# EAGLE design AxionAdapterPogo (EAGLE 9.6.2)
REV: 1
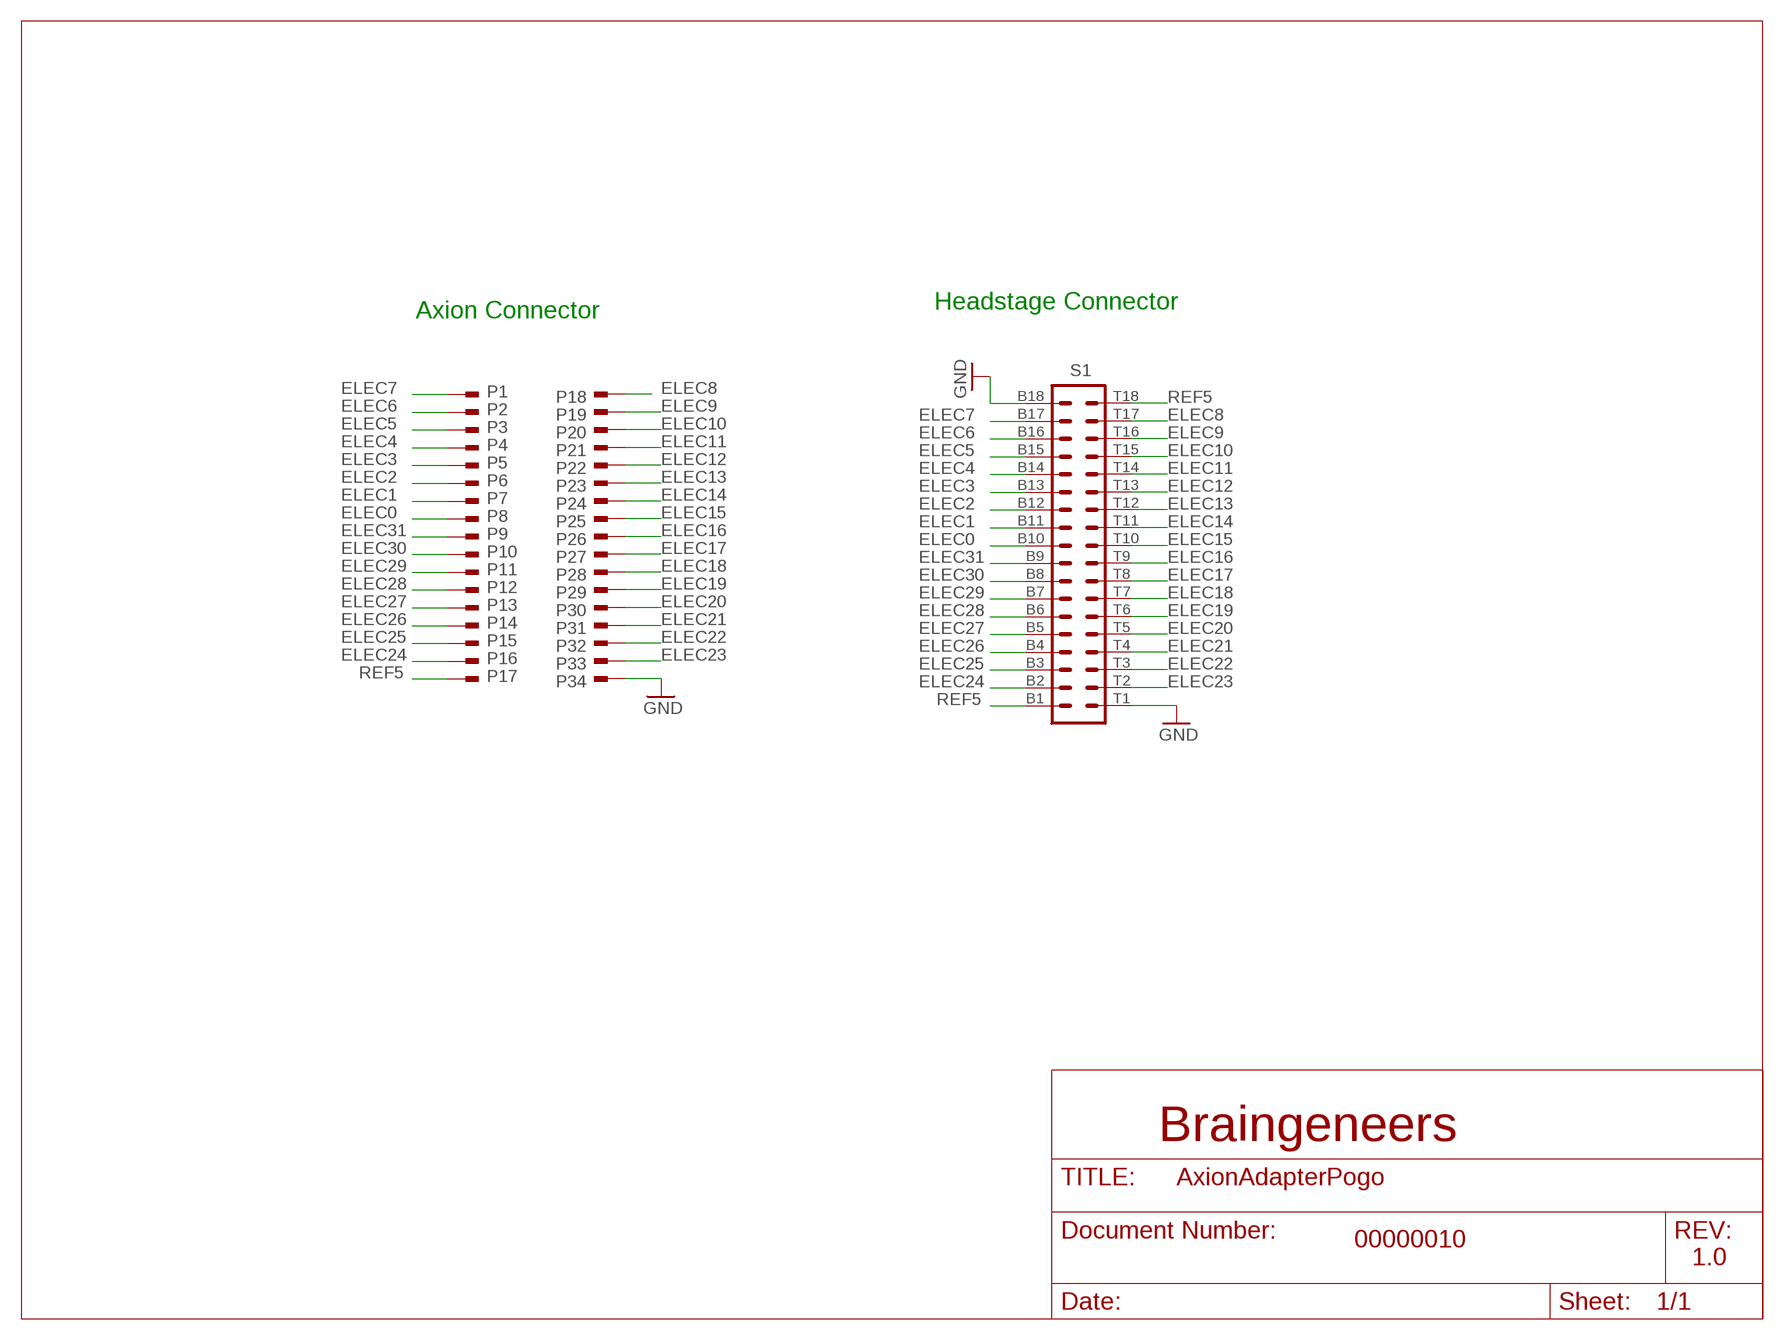
[diagram p0: schematic, sheet 1]

## Parts
P1  MILL-MAX_POGO_0985-0-15-20-71-14-11-0  [MILL-MAX_POGO_0985-0-15-20-71-14-11-0]
P2  MILL-MAX_POGO_0985-0-15-20-71-14-11-0  [MILL-MAX_POGO_0985-0-15-20-71-14-11-0]
P3  MILL-MAX_POGO_0985-0-15-20-71-14-11-0  [MILL-MAX_POGO_0985-0-15-20-71-14-11-0]
P4  MILL-MAX_POGO_0985-0-15-20-71-14-11-0  [MILL-MAX_POGO_0985-0-15-20-71-14-11-0]
P5  MILL-MAX_POGO_0985-0-15-20-71-14-11-0  [MILL-MAX_POGO_0985-0-15-20-71-14-11-0]
P6  MILL-MAX_POGO_0985-0-15-20-71-14-11-0  [MILL-MAX_POGO_0985-0-15-20-71-14-11-0]
P7  MILL-MAX_POGO_0985-0-15-20-71-14-11-0  [MILL-MAX_POGO_0985-0-15-20-71-14-11-0]
P8  MILL-MAX_POGO_0985-0-15-20-71-14-11-0  [MILL-MAX_POGO_0985-0-15-20-71-14-11-0]
P9  MILL-MAX_POGO_0985-0-15-20-71-14-11-0  [MILL-MAX_POGO_0985-0-15-20-71-14-11-0]
P10  MILL-MAX_POGO_0985-0-15-20-71-14-11-0  [MILL-MAX_POGO_0985-0-15-20-71-14-11-0]
P11  MILL-MAX_POGO_0985-0-15-20-71-14-11-0  [MILL-MAX_POGO_0985-0-15-20-71-14-11-0]
P12  MILL-MAX_POGO_0985-0-15-20-71-14-11-0  [MILL-MAX_POGO_0985-0-15-20-71-14-11-0]
P13  MILL-MAX_POGO_0985-0-15-20-71-14-11-0  [MILL-MAX_POGO_0985-0-15-20-71-14-11-0]
P14  MILL-MAX_POGO_0985-0-15-20-71-14-11-0  [MILL-MAX_POGO_0985-0-15-20-71-14-11-0]
P15  MILL-MAX_POGO_0985-0-15-20-71-14-11-0  [MILL-MAX_POGO_0985-0-15-20-71-14-11-0]
P16  MILL-MAX_POGO_0985-0-15-20-71-14-11-0  [MILL-MAX_POGO_0985-0-15-20-71-14-11-0]
P17  MILL-MAX_POGO_0985-0-15-20-71-14-11-0  [MILL-MAX_POGO_0985-0-15-20-71-14-11-0]
P18  MILL-MAX_POGO_0985-0-15-20-71-14-11-0  [MILL-MAX_POGO_0985-0-15-20-71-14-11-0]
P19  MILL-MAX_POGO_0985-0-15-20-71-14-11-0  [MILL-MAX_POGO_0985-0-15-20-71-14-11-0]
P20  MILL-MAX_POGO_0985-0-15-20-71-14-11-0  [MILL-MAX_POGO_0985-0-15-20-71-14-11-0]
P21  MILL-MAX_POGO_0985-0-15-20-71-14-11-0  [MILL-MAX_POGO_0985-0-15-20-71-14-11-0]
P22  MILL-MAX_POGO_0985-0-15-20-71-14-11-0  [MILL-MAX_POGO_0985-0-15-20-71-14-11-0]
P23  MILL-MAX_POGO_0985-0-15-20-71-14-11-0  [MILL-MAX_POGO_0985-0-15-20-71-14-11-0]
P24  MILL-MAX_POGO_0985-0-15-20-71-14-11-0  [MILL-MAX_POGO_0985-0-15-20-71-14-11-0]
P25  MILL-MAX_POGO_0985-0-15-20-71-14-11-0  [MILL-MAX_POGO_0985-0-15-20-71-14-11-0]
P26  MILL-MAX_POGO_0985-0-15-20-71-14-11-0  [MILL-MAX_POGO_0985-0-15-20-71-14-11-0]
P27  MILL-MAX_POGO_0985-0-15-20-71-14-11-0  [MILL-MAX_POGO_0985-0-15-20-71-14-11-0]
P28  MILL-MAX_POGO_0985-0-15-20-71-14-11-0  [MILL-MAX_POGO_0985-0-15-20-71-14-11-0]
P29  MILL-MAX_POGO_0985-0-15-20-71-14-11-0  [MILL-MAX_POGO_0985-0-15-20-71-14-11-0]
P30  MILL-MAX_POGO_0985-0-15-20-71-14-11-0  [MILL-MAX_POGO_0985-0-15-20-71-14-11-0]
P31  MILL-MAX_POGO_0985-0-15-20-71-14-11-0  [MILL-MAX_POGO_0985-0-15-20-71-14-11-0]
P32  MILL-MAX_POGO_0985-0-15-20-71-14-11-0  [MILL-MAX_POGO_0985-0-15-20-71-14-11-0]
P33  MILL-MAX_POGO_0985-0-15-20-71-14-11-0  [MILL-MAX_POGO_0985-0-15-20-71-14-11-0]
P34  MILL-MAX_POGO_0985-0-15-20-71-14-11-0  [MILL-MAX_POGO_0985-0-15-20-71-14-11-0]
S1  OMNETICS_A79024  [OMNETICS_A79024]

## Nets
ELEC0: P8.P$1 S1.B10
ELEC1: P7.P$1 S1.B11
ELEC2: P6.P$1 S1.B12
ELEC3: P5.P$1 S1.B13
ELEC4: P4.P$1 S1.B14
ELEC5: P3.P$1 S1.B15
ELEC6: P2.P$1 S1.B16
ELEC7: P1.P$1 S1.B17
ELEC8: P18.P$1 S1.T17
ELEC9: P19.P$1 S1.T16
ELEC10: P20.P$1 S1.T15
ELEC11: P21.P$1 S1.T14
ELEC12: P22.P$1 S1.T13
ELEC13: P23.P$1 S1.T12
ELEC14: P24.P$1 S1.T11
ELEC15: P25.P$1 S1.T10
ELEC16: P26.P$1 S1.T9
ELEC17: P27.P$1 S1.T8
ELEC18: P28.P$1 S1.T7
ELEC19: P29.P$1 S1.T6
ELEC20: P30.P$1 S1.T5
ELEC21: P31.P$1 S1.T4
ELEC22: P32.P$1 S1.T3
ELEC23: P33.P$1 S1.T2
ELEC24: P16.P$1 S1.B2
ELEC25: P15.P$1 S1.B3
ELEC26: P14.P$1 S1.B4
ELEC27: P13.P$1 S1.B5
ELEC28: P12.P$1 S1.B6
ELEC29: P11.P$1 S1.B7
ELEC30: P10.P$1 S1.B8
ELEC31: P9.P$1 S1.B9
GND [power]: P34.P$1 S1.B18 S1.T1
REF5: P17.P$1 S1.B1 S1.T18

## Notes on the sheet
- Headstage Connector
- Axion Connector
- Braingeneers
- 00000010
- 1.0

## Library data of the parts
P1-P34 = Braingeneers_Lib:MILL-MAX_POGO_0985-0-15-20-71-14-11-0
S1 = Braingeneers_Lib:OMNETICS_A79024: Omnetics A79024 36-pin connector

## Net classes
0 default: width 0.152 mm
1 thick: width 0.254 mm
2 power: width 0.61 mm
3 diff pairs: width 0.152 mm

## Board
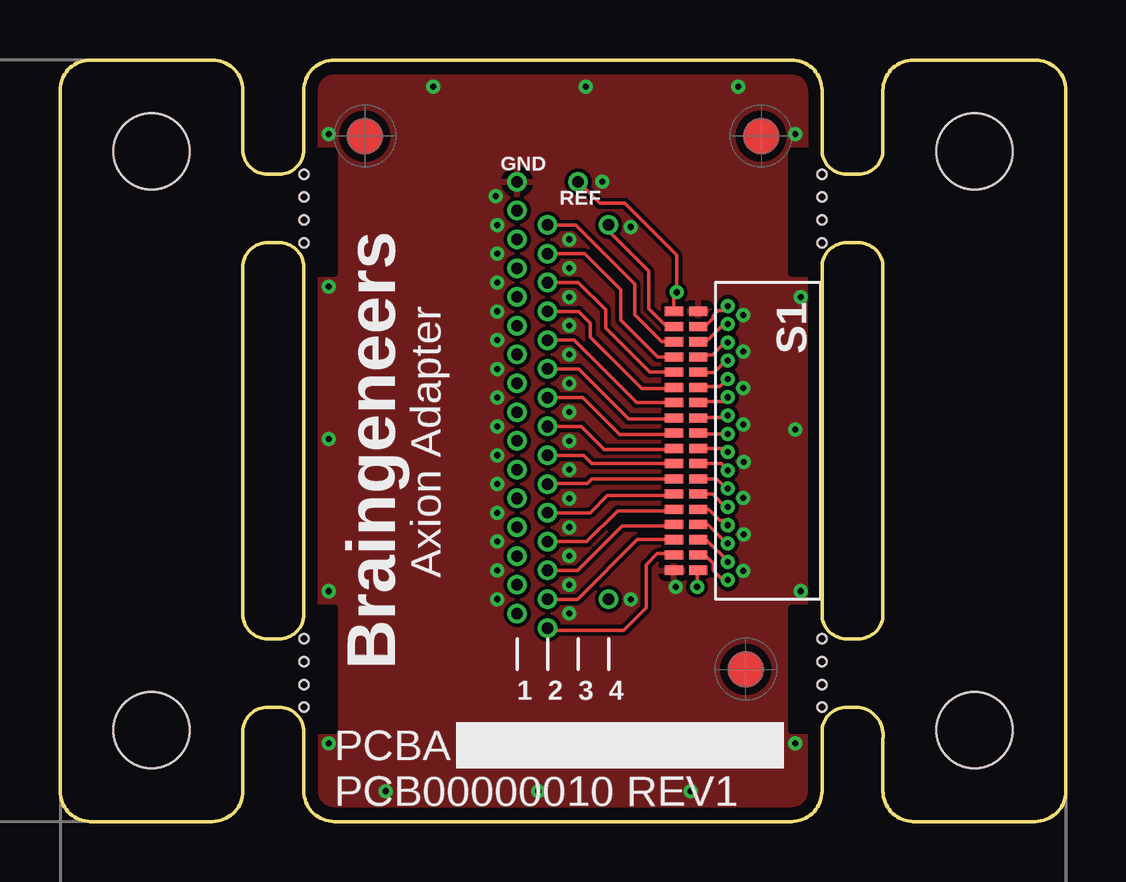
[diagram p1: board, top side]
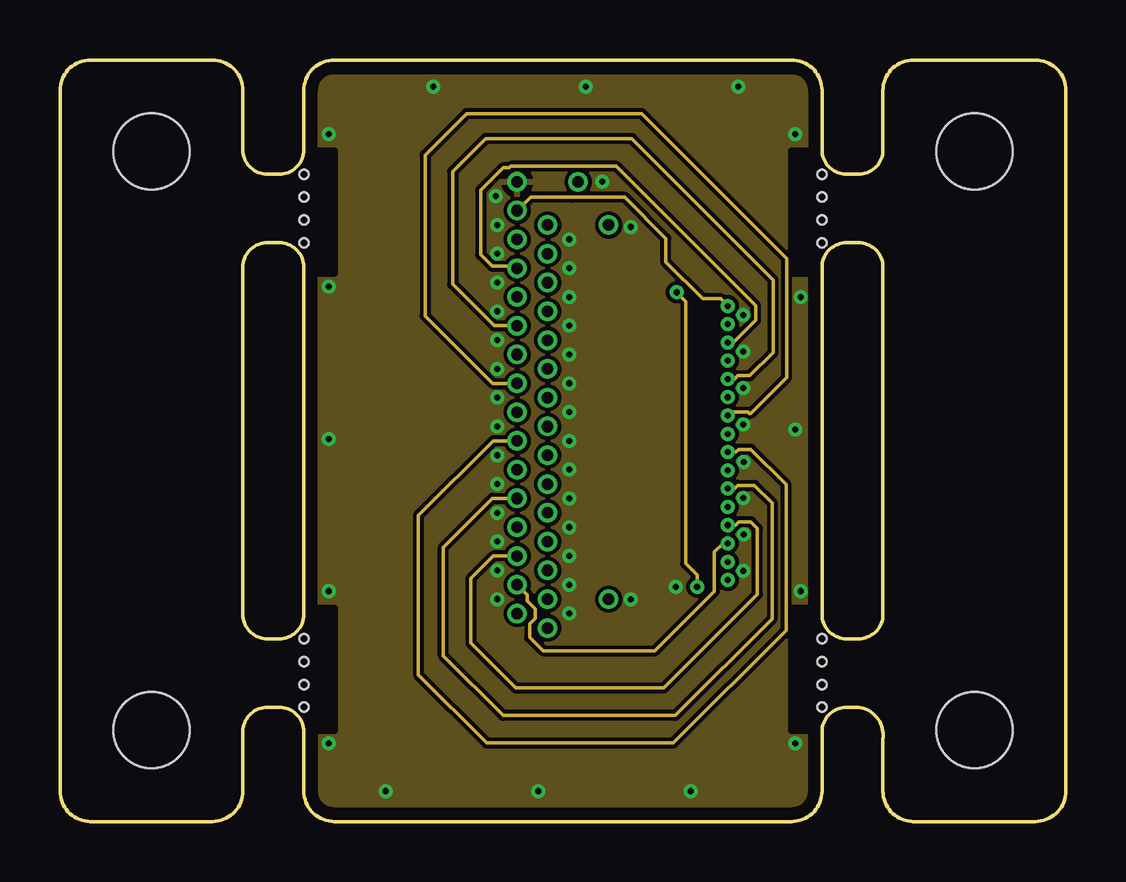
[diagram p2: board, inner layer Signal/Power2]
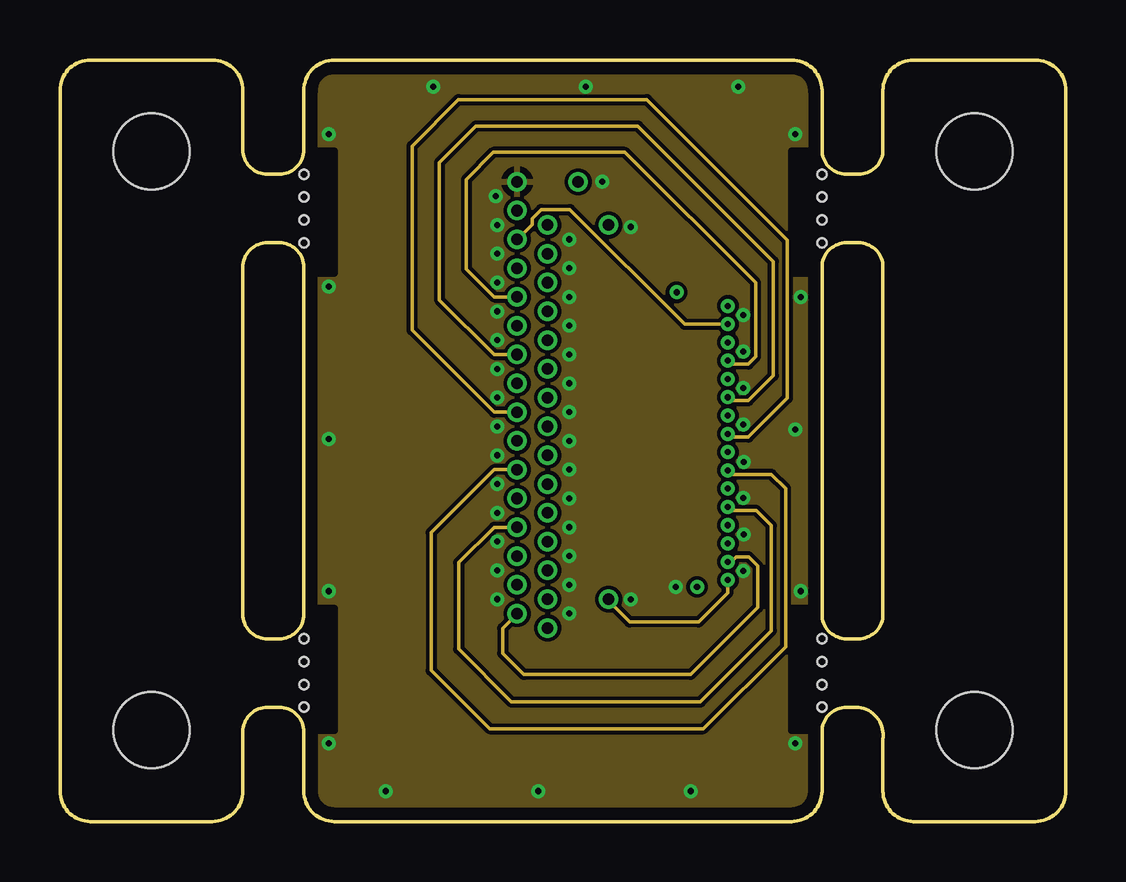
[diagram p3: board, inner layer Signal/Power3]
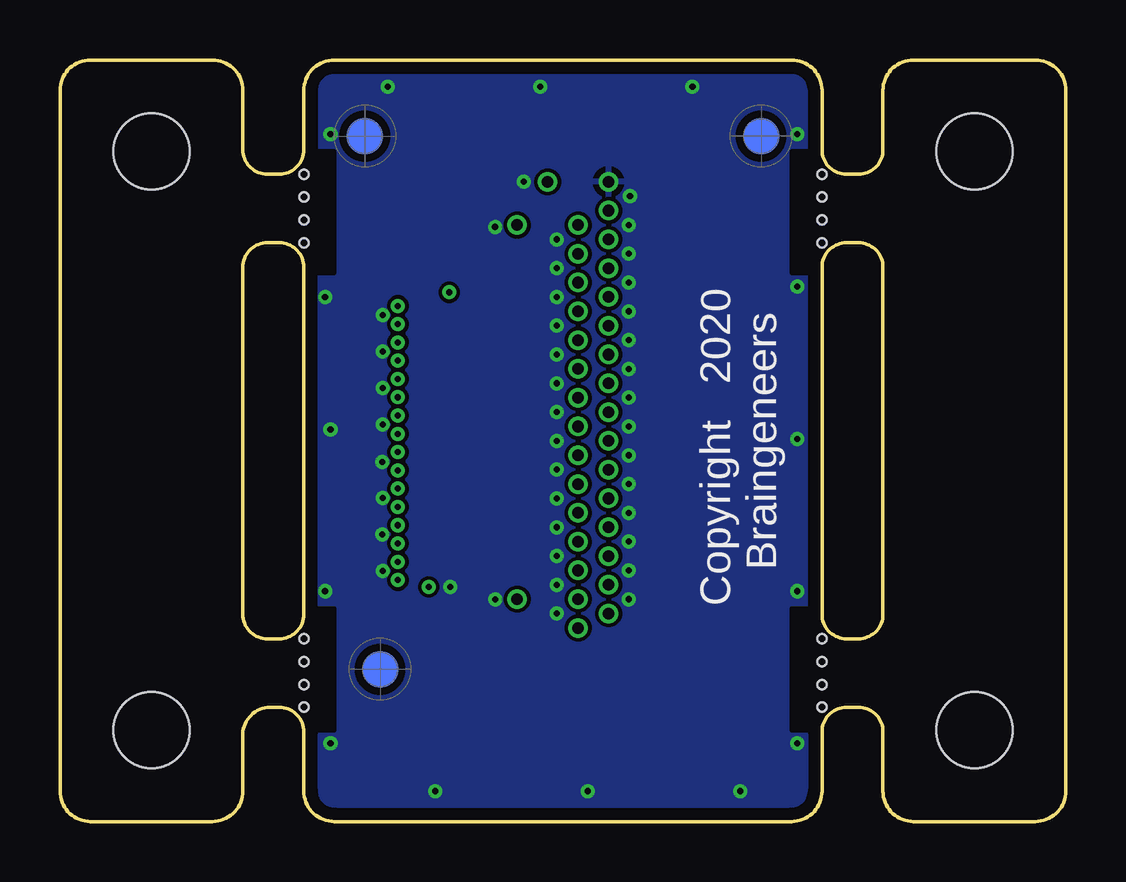
[diagram p4: board, bottom side, seen from below]

Size 41.91 x 31.75 mm. Coordinates in mm from the lower left corner, seen from the top.
Outline: 31.75,1.27 31.75,3.75 arc-90 32.77,4.76 33.27,4.76 arc-90 34.29,3.43 34.29,1.27 arc90 35.56,0 40.64,0 arc90 41.91,1.27 41.91,30.48 arc90 40.64,31.75 35.56,31.75 arc90 34.29,30.48 34.29,28 arc-90 33.27,26.99 32.77,26.99 arc-90 31.75,28 31.75,30.48 arc90 30.48,31.75 11.43,31.75 arc90 10.16,30.48 10.16,28 arc-90 9.14,26.99 8.64,26.99 arc-90 7.62,28 7.62,30.48 arc90 6.35,31.75 1.27,31.75 arc90 0,30.48 0,1.27 arc90 1.27,0 6.35,0 arc90 7.62,1.27 7.62,3.75 arc-90 8.64,4.76 9.14,4.76 arc-90 10.16,3.75 10.16,1.27 arc90 11.43,0 30.48,0 arc90 31.75,1.27
Outline: 8.64,24.13 9.14,24.13 arc-90 10.16,23.11 10.16,8.64 arc-90 9.14,7.62 8.64,7.62 arc-90 7.62,8.64 7.62,23.11 arc-90 8.64,24.13
Outline: 31.75,8.64 31.75,23.11 arc-90 32.77,24.13 33.27,24.13 arc-90 34.29,23.11 34.29,8.64 arc-90 33.27,7.62 32.77,7.62 arc-90 31.75,8.64
Copper layers (1+2*15+16): Top(GND)1 0.035mm / dielectric 8mil / Signal/Power2 0.035mm / dielectric 1.0284mm / Signal/Power3 0.035mm / dielectric 8mil / Bottom(GND)4 0.035mm
Design rules "default *": minimum track width 6mil, minimum drill 10mil, track to track 6mil, track to pad 6.5mil, pad to pad 6mil, via to via 6mil, smd to smd 6mil, copper to edge 20mil, drill to drill 15mil, minimum pad ring 6.5mil, minimum via ring 6.5mil, stop-mask expansion 3mil, vias tented up to drill 12mil, thermal gap 10mil
Holes 0.38 mm at 31.75,4.76 31.75,7.62 31.75,6.67 31.75,5.72 31.75,24.13 31.75,26.99 31.75,26.04 31.75,25.08 10.16,24.13 10.16,26.99 10.16,26.04 10.16,25.08 10.16,4.76 10.16,7.62 10.16,6.67 10.16,5.72
Holes 3.17 mm at 38.1,3.81 38.1,27.94 3.81,27.94 3.81,3.81
tKeepout: area 10.2,22.9 to 11.4,27.9; area 10.2,3.8 to 11.4,8.9; area 30.5,3.8 to 31.8,8.9; area 30.5,22.9 to 31.8,27.9
bKeepout: area 10.2,22.9 to 11.4,27.9; area 10.2,3.8 to 11.4,8.9; area 30.5,3.8 to 31.8,8.9; area 30.5,22.9 to 31.8,27.9
tRestrict: area 10.2,22.9 to 11.4,27.9; area 30.5,22.9 to 31.8,27.9; area 30.5,3.8 to 31.8,8.9; area 10.2,3.8 to 11.4,8.9
bRestrict: area 10.2,22.9 to 11.4,27.9; area 10.2,3.8 to 11.4,8.9; area 30.5,3.8 to 31.8,8.9; area 30.5,22.9 to 31.8,27.9

### Footprints (pad centres in the part's own frame; a part is rotated, then mirrored left to right if it is on the bottom)
MILL-MAX_POGO_0985-0-15-20-71-14-11-0 = drill 0.483: P$1 0,0
OMNETICS_A79024 = smd 0.381 x 0.762: B1 -5.397,0.711; B2 -4.763,0.711; B3 -4.128,0.711; B4 -3.493,0.711; B5 -2.857,0.711; B6 -2.223,0.711; B7 -1.587,0.711; B8 -0.953,0.711; B9 -0.318,0.711; B10 0.318,0.711; B11 0.953,0.711; B12 1.587,0.711; B13 2.223,0.711; B14 2.857,0.711; B15 3.493,0.711; B16 4.128,0.711; B17 4.763,0.711; B18 5.397,0.711; T1 -5.397,1.727; T2 -4.763,1.727; T3 -4.128,1.727; T4 -3.493,1.727; T5 -2.857,1.727; T6 -2.223,1.727; T7 -1.587,1.727; T8 -0.953,1.727; T9 -0.318,1.727; T10 0.318,1.727; T11 0.953,1.727; T12 1.587,1.727; T13 2.223,1.727; T14 2.857,1.727; T15 3.493,1.727; T16 4.128,1.727; T17 4.763,1.727; T18 5.397,1.727

### Placement (x,y rotation side)
DRILEGEND  [DRILEGEND]  21.21,-23.02 0 top  (outside the outline)
P1  19.05,25.47 180 bottom
P2  19.05,24.27 180 bottom
P3  19.05,23.07 180 bottom
P4  19.05,21.87 180 bottom
P5  19.05,20.67 180 bottom
P6  19.05,19.47 180 bottom
P7  19.05,18.27 180 bottom
P8  19.05,17.07 180 bottom
P9  19.05,15.87 180 bottom
P10  19.05,14.67 180 bottom
P11  19.05,13.47 180 bottom
P12  19.05,12.27 180 bottom
P13  19.05,11.07 180 bottom
P14  19.05,9.87 180 bottom
P15  19.05,8.67 180 bottom
P16  22.86,9.27 90 bottom
P17  21.59,26.67 0 bottom
P18  22.86,24.87 90 bottom
P19  20.32,24.87 0 bottom
P20  20.32,23.67 0 bottom
P21  20.32,22.47 0 bottom
P22  20.32,21.27 0 bottom
P23  20.32,20.07 0 bottom
P24  20.32,18.87 0 bottom
P25  20.32,17.67 0 bottom
P26  20.32,16.47 0 bottom
P27  20.32,15.27 0 bottom
P28  20.32,14.07 0 bottom
P29  20.32,12.87 0 bottom
P30  20.32,11.67 0 bottom
P31  20.32,10.47 0 bottom
P32  20.32,9.27 0 bottom
P33  20.32,8.07 0 bottom
P34  19.05,26.67 180 bottom
S1  27.3,15.88 90 top
U$1  [FIDUCIAL_G15]  12.7,28.58 270 top
U$2  [FIDUCIAL_G15]  12.7,28.58 270 bottom
U$7  [NASS_LOGO_LG]  27.42,2.48 349.7 bottom
U$31  [ROHS_LG]  24.44,9.01 0 top
U$35  [FIDUCIAL_G15]  29.21,28.58 270 top
U$49  [FIDUCIAL_G15]  28.58,6.35 90 top
U$50  [FIDUCIAL_G15]  28.58,6.35 270 bottom
U$52  [A5L-LOC]  -25.3,-72.07 0 top  (outside the outline)
U$70  [NO_TRASH_LG]  22.96,16.64 0 top
U$72  [STATIC_LG]  23.54,12.53 0 top
U$73  [FIDUCIAL_G15]  29.21,28.58 0 bottom
U$84  [COMPYRIGHT_MED]  13.34,17.15 270 top

### Tracks (layer width: path | path; a pad name or v marks a point on that pad's centre or on a via)
ELEC0  (via drill 0.25)
  Top(GND)1 0.152: v27.83,16.16 26.62,16.16
  Top(GND)1 0.178: S1.B10 26.62,16.16
  Signal/Power3 0.152: v27.83,16.16 27.97,16.02 28.68,16.02 30.3,17.65 30.3,24.24 24.45,30.1 16.6,30.1 14.67,28.16 14.67,20.49 18.08,17.07 P8.P$1
ELEC1  (via drill 0.25)
  Top(GND)1 0.152: v27.83,16.93 27.75,16.85 26.61,16.85
  Top(GND)1 0.178: 26.61,16.85 S1.B11
  Signal/Power2 0.152: v27.83,16.93 27.97,17.07 28.68,17.07 28.73,17.02 28.78,17.02 30.28,18.52 30.28,23.47 24.23,29.52 16.94,29.52 15.21,27.79 15.21,21.08 18.03,18.27 P7.P$1
ELEC2  (via drill 0.25)
  Top(GND)1 0.152: v27.83,17.69 27.65,17.51 26.64,17.51 S1.B12
  Signal/Power3 0.152: v27.83,17.69 27.97,17.55 28.68,17.55 29.72,18.59 29.72,23.35 24.07,28.99 17.33,28.99 15.81,27.48 15.81,21.74 18.08,19.47 P6.P$1
ELEC3  (via drill 0.25)
  Top(GND)1 0.152: S1.B13 26.64,18.14 27.49,18.14 27.8,18.45 v27.83,18.45
  Signal/Power2 0.152: v27.83,18.45 28.11,18.45 28.25,18.59 28.75,18.59 29.72,19.56 29.72,22.58 23.82,28.47 17.73,28.47 16.36,27.1 16.36,22.4 18.08,20.67 P5.P$1
ELEC4  (via drill 0.25)
  Top(GND)1 0.152: S1.B14 27.26,18.73 27.75,19.21 v27.83,19.21
  Signal/Power3 0.152: v27.83,19.21 27.97,19.07 28.68,19.07 28.98,19.38 28.98,22.46 23.54,27.9 18.06,27.9 16.93,26.77 16.93,23.03 18.08,21.87 P4.P$1
ELEC5  (via drill 0.25)
  Top(GND)1 0.152: v27.83,19.97 27.7,19.97 27.17,19.44 26.67,19.44 S1.B15
  Signal/Power2 0.152: v27.83,19.97 28.06,19.97 28.98,20.9 28.98,21.51 23.18,27.32 18.78,27.32 18.72,27.25 18.47,27.25 17.53,26.31 17.53,23.63 18,23.15 18.97,23.15 P3.P$1
ELEC6  (via drill 0.25)
  Top(GND)1 0.152: v27.83,20.74 27.65,20.74 26.92,20 S1.B16
  Signal/Power3 0.152: P2.P$1 19.67,24.89 19.67,25.14 20.05,25.52 21.25,25.52 26.03,20.74 v27.83,20.74
ELEC7  (via drill 0.25)
  Top(GND)1 0.152: v27.83,21.5 27.63,21.3 27.42,21.3 27.22,21.09 27.22,20.98 26.87,20.64 S1.B17
  Signal/Power2 0.152: v27.83,21.5 27.53,21.79 26.77,21.79 25.25,23.32 25.25,24.31 23.53,26.02 21.32,26.02 21.31,26.04 19.62,26.04 P1.P$1
ELEC8
  Top(GND)1 0.152: P18.P$1 22.86,24.62 24.52,22.95 24.52,21.39 25.27,20.64 S1.T17
ELEC9
  Top(GND)1 0.152: P19.P$1 21.48,24.87 23.95,22.4 23.95,21.13 25.08,20 S1.T16
ELEC10
  Top(GND)1 0.152: S1.T15 24.91,19.37 23.37,20.91 23.37,22.17 21.86,23.67 P20.P$1
ELEC11
  Top(GND)1 0.152: S1.T14 24.57,18.73 22.73,20.57 22.73,21.34 21.6,22.47 P21.P$1
ELEC12
  Top(GND)1 0.152: P22.P$1 21.61,21.27 22.1,20.78 22.1,20.19 24.24,18.05 25.53,18.05 S1.T13
ELEC13
  Top(GND)1 0.152: P23.P$1 21.42,20.07 24.03,17.46 S1.T12
ELEC14
  Top(GND)1 0.152: S1.T11 25.53,16.78 23.7,16.78 21.61,18.87 P24.P$1
ELEC15
  Top(GND)1 0.152: S1.T10 25.53,16.14 23.32,16.14 21.79,17.67 P25.P$1
ELEC16
  Top(GND)1 0.152: S1.T9 25.53,15.51 22.68,15.51 21.72,16.47 P26.P$1
ELEC17
  Top(GND)1 0.152: P27.P$1 21.81,15.27 22.16,14.92 S1.T8
ELEC18
  Top(GND)1 0.152: P28.P$1 20.35,14.1 21.97,14.1 22.16,14.29 S1.T7
ELEC19
  Top(GND)1 0.152: P29.P$1 22.09,12.87 22.81,13.59 25.51,13.59 S1.T6
ELEC20
  Top(GND)1 0.152: P30.P$1 21.96,11.67 23.24,12.95 25.51,12.95 S1.T5
ELEC21
  Top(GND)1 0.152: P31.P$1 21.57,10.47 23.42,12.32 25.51,12.32 S1.T4
ELEC22
  Top(GND)1 0.152: P32.P$1 21.56,9.27 24.05,11.76 25.57,11.76 S1.T3
ELEC23
  Top(GND)1 0.152: S1.T2 25.51,11.18 24.89,11.18 24.42,10.71 24.42,8.91 23.48,7.98 20.41,7.98 P33.P$1
ELEC24  (via drill 0.25)
  Top(GND)1 0.152: v27.83,10.07 27.62,10.07 27.22,10.47 27.22,10.77 26.87,11.11 S1.B2
  Signal/Power3 0.152: P16.P$1 22.86,9.19 23.73,8.32 26.61,8.32 27.83,9.54 v27.83,10.07
ELEC25  (via drill 0.25)
  Top(GND)1 0.152: v27.83,10.83 27.83,10.86 26.94,11.75 S1.B3
  Signal/Power3 0.152: v27.83,10.83 27.98,10.83 28.18,11.03 28.69,11.03 29.07,10.65 29.07,8.93 26.28,6.13 19.33,6.13 18.44,7.02 18.44,8.06 P15.P$1
ELEC26  (via drill 0.25)
  Top(GND)1 0.152: S1.B4 26.62,12.36 27.01,12.36 27.78,11.59 v27.83,11.59
  Signal/Power2 0.152: P14.P$1 19.47,9.45 19.47,9.21 19.8,8.88 19.8,8.47 19.57,8.24 19.57,7.68 20.13,7.12 24.78,7.12 27.26,9.6 27.26,11.23 27.63,11.59 v27.83,11.59
ELEC27  (via drill 0.25)
  Top(GND)1 0.152: v27.83,12.35 27.63,12.56 27.5,12.56 27.04,13.02 S1.B5
  Signal/Power2 0.152: P13.P$1 18.05,11.07 17.12,10.14 17.12,7.44 19,5.56 25.15,5.56 29.06,9.47 29.06,12.22 28.78,12.49 28.27,12.49 28.13,12.35 v27.83,12.35
ELEC28  (via drill 0.25)
  Top(GND)1 0.152: v27.83,13.12 27.73,13.12 27.19,13.65 S1.B6
  Signal/Power3 0.152: P12.P$1 18.08,12.27 16.61,10.79 16.61,7.19 18.81,4.98 26.68,4.98 29.64,7.95 29.64,12.34 29.01,12.98 27.97,12.98 v27.83,13.12
ELEC29  (via drill 0.25)
  Top(GND)1 0.152: v27.83,13.88 27.78,13.88 27.37,14.29 S1.B7
  Signal/Power2 0.152: v27.83,13.88 28.11,13.88 28.25,14.02 28.93,14.02 29.67,13.28 29.67,8.46 25.63,4.42 18.47,4.42 15.98,6.91 15.98,11.43 18.02,13.47 P11.P$1
ELEC30  (via drill 0.25)
  Top(GND)1 0.152: v27.83,14.64 27.55,14.92 S1.B8
  Signal/Power3 0.152: v27.83,14.64 27.99,14.48 29.64,14.48 30.23,13.89 30.23,7.29 26.81,3.87 17.9,3.87 15.46,6.3 15.46,12.05 18.08,14.67 P10.P$1
ELEC31  (via drill 0.25)
  Top(GND)1 0.152: v27.83,15.4 27.67,15.56 S1.B9
  Signal/Power2 0.152: P9.P$1 18.05,15.87 14.94,12.75 14.94,6.12 17.78,3.28 25.55,3.28 30.25,7.98 30.25,14.05 28.78,15.52 28.27,15.52 28.16,15.4 v27.83,15.4
GND  (via drill 0.25)
  other vias: 18.16,26.07 18.22,24.87 18.22,23.67 18.22,22.47 18.22,21.27 18.22,20.07 18.22,18.87 18.22,17.67 18.22,16.47 18.22,15.27 18.22,14.07 18.22,12.87 18.22,11.67 18.22,10.47 18.22,9.27 22.59,26.67 21.22,9.87 21.22,24.27 21.22,23.07 25.65,9.78 28.46,10.45 28.46,21.12 28.46,19.59 28.46,18.07 28.46,16.55 28.49,15 28.46,13.5 28.49,11.97 21.22,8.67 23.78,24.79 11.19,28.65 28.26,30.64 30.64,28.65 30.87,21.86 30.87,9.6 11.19,22.3 26.27,1.27 11.19,3.25 11.19,9.6 11.19,15.95 30.64,16.35 21.22,11.07 21.22,12.27 21.22,13.47 21.22,14.67 21.22,15.87 21.22,17.07 21.22,18.27 21.22,19.47 21.22,20.67 21.22,21.87 23.78,9.26 30.64,3.25 19.92,1.27 15.56,30.64 21.91,30.64 13.57,1.27
  pour Bottom(GND)4 (rank 2): -15.93,-15.67 54.15,-15.67 54.15,46.87 -15.93,46.87
  pour Signal/Power3: -13.72,45.09 52.2,45.09 52.2,-14.35 -13.72,-14.35
  pour Signal/Power2: -11.43,-12.7 49.53,-12.7 49.53,43.18 -11.43,43.18
  pour Top(GND)1: -8.89,-10.16 46.99,-10.16 46.99,40.64 -8.89,40.64
REF5  (via drill 0.25)
  Top(GND)1 0.152: S1.B1 26.54,10.43 v26.54,9.78 | S1.T18 25.58,21.95 v25.69,22.06 25.69,23.62 23.54,25.77 22.49,25.77 P17.P$1
  Signal/Power2 0.152: v25.69,22.06 26.07,21.68 26.07,10.76 26.54,10.29 v26.54,9.78
TABS
  cutout Signal/Power3 (rank 2): 10.16,22.86 11.43,22.86 11.43,27.94 10.16,27.94
  cutout Signal/Power2 (rank 2): 10.16,22.86 11.43,22.86 11.43,27.94 10.16,27.94
TABS1
  cutout Signal/Power3: 10.16,3.81 11.43,3.81 11.43,8.89 10.16,8.89
TABS2
  cutout Signal/Power2: 30.48,3.81 31.75,3.81 31.75,8.89 30.48,8.89
  cutout Signal/Power3: 30.48,3.81 31.75,3.81 31.75,8.89 30.48,8.89
TABS3
  cutout Signal/Power2: 30.48,22.86 31.75,22.86 31.75,27.94 30.48,27.94
  cutout Signal/Power3: 30.48,22.86 31.75,22.86 31.75,27.94 30.48,27.94
TABS4
  cutout Signal/Power2 (rank 2): 10.16,3.81 11.43,3.81 11.43,8.89 10.16,8.89

### Text on the board
tPlace: GND | REF | Axion Adapter | Braingeneers | 1 | 2 | 3 | 4 | PCBA | PCB00000010 REV1
bPlace: Copyright 2020 / Braingeneers
Document: DWG 00000010 | REV 1 | UNLESS OTHERWISE SPECIFIED / / DIMENSIONS ARE IN INCHES / TOLERANCES ON; / 2 PL DECIMALS +/- 0.010 / 3 PL DECIMALS +/- 0.005 / ANGLES + / FRACTIONS +
tDocu: TOP | NOTES: UNLESS OTHERWISE SPECIFIED: / / 1. WORKMANSHIP SHALL BE IN ACCORDANCE / WITH IPC-A-610A CLASS 2 REQUIREMENTS. / / 2. NOTE POLARITY OF COMPONENTS WHEN INDICATED. / / 3. SQUARE PAD OR DOT INDICATES PIN 1 OF DEVICE, + END OF CAPACITOR, / CATHODE END OF DIODES, EMITTER OF TRANSISTOR / AND PIN 1 OF A CONNECTOR. / / 4. INSERT ASSEMBLED BOARD INTO CONDUCTIVE BAG. / / 5. SEE BOM FOR REFERENCE DESIGNATORS OF / STUFFED AND UNSTUFFED COMPONENTS. / / 6. REWORK MUST CONFORM TO IPC GUIDELINES IPC-R-700C. / / 7. PCB ASSEMBLY PROCESS AND VENDOR-SUPPLIED ASSEMBLY MATERIALS / MUST BE RoHS 2 COMPLIANT (2011/EU) AND REACH COMPLIANT (EC 1907/2006) / / 8. USE A NO-WASH ASSEMBLY PROCESS. USE ONLY NO-CLEAN FLUX. / / 9. SEE BOM FOR ANY ADDITIONAL ASSEMBLY NOTES. | ASSEMBLY
DOC: BOTTOM | ASSEMBLY
DrillLegend: LAYER-STACK
DrillLegend_01-16: 01-16
DrillLegend_01-20: 01-20
Notes: TOP SIDE | DRILL CHART (ALL UNITS IN MILS) | OK WITH DEFAULT TOLERANCES | NOTES: UNLESS OTHERWISE SPECIFIED: / / 1. PCB TO BE FABRICATED PER IPC GUIDELINES: / IPC-A-6012B OR LATEST REVISION. IPC-D-275 AND IPC-RB-276 CLASS 2 OR LATEST REVISION. / / 2. FINISHED BOARD TO BE 0.062IN +/- 10% THINK. / MATERIAL: ITEQ IT-180A, OR 370HR FR4, OR EQUIVALENT. / 4 LAYERS. LAYERS 1 AND 4 TO HAVE 1 OZ. MIN COPPER CLAD BEFORE PLATING, / AND PLATE PER IPC-6012. / COPPER PLATE ON WALL OF HOLES SHALL BE 0.001 AVERAGE, 0.0008 ABSOLUTE MINIMUM / / 3. MINIMUM ANNULAR RING IS O.002 FOR COMPONENT HOLES, TANGENCY FOR VIAS. / / 4. MASTER ARTWORK (FILM/GERBER DATA) IS NOT ETCH COMPENSATED. / COMPENSATE WORKING FILM SUCH THAT TRACE WIDTHS / MATCH TRACE WIDTHS OF MASTER ARTWORK WITHIN +/- 20% OF TRACE WIDTH / / 5. USE GREEN LIQUID PHOTO IMAGEABLE SOLDER MASK / CONFORMING TO IPC-SM-840C CLASS H. / BOARD TO HAVE SOLDER MASK OVER BARE COPPER ON BOTH SIDES. / NO SOLDER MASK TO PAD PERMISSIBLE, EXCEPT VIAS. / VIAS ARE TO BE MASKED PER ARTWORK MASTER. / / 6. SILKSCREEN BOTH SIDES USING SILKSCREEN MASTER. / SILKSCREEN TO BE WHITE NON-CONDUCTIVE, NON-NUTRIENT EPOXY INK, / OR ACRYLIC PRINT TAIYO IJR-4000 MW300. / / 7. WARPAGE NOT TO EXCEED 0.10 PER LINEAR INCH / / 8. PCB MUST PASS 100% ELECTRICAL TESTING / FOR OPENS AND SHORTS IN ACCORDANCE WITH IPC-ET-652. / TRUE NETLIST TESTING REQUIRED USING SUPPLIED IPC NETLIST. / / 9. ALL REWORK MUST FONCOFM TO IPC GUIDELINES: / IPC-R-700C (OR MOST CURRENT REVISION). / / 10. MINIMUM CONDUCTOR WITH TO BE 0.007”. / MINIMUM CONDUCTOR TO CONDUCTOR AND CONDUCTOR TO PAD SPACING TO BE 0.007” / / 11. SURFACE FINISH: ENIG (ELECTROLESS NICKEL IMMERSION GOLD) / 2-5 MICRO INCHES IMMERSION (SOFT) GOLD PLATE OVER 118-236 MICO INCHES NICKEL / / 12. ALL SOLDER PADS TO BE FREE OF SILKSCREEN INK. / / 13. PCB SHALL BE ROHS 2 COMPLIANT (2011/65/EU), REACH COMPLIANT (EC1907/2006) / AND COMPATIBLE WITH ROHS ASSEMBLY PROCESS / / 14. VIA REQUIREMENTS: FOLLOW SUPPLIED GERBERS. / SOLDER MASK ON PAD - FOLLOW SOLDER MASK GERBER FILES / / 15. OK TO ADD COPPER THIEVING TO SPARSELY POPULATED AREAS OF PCB AS NEEDED / / 16. IF COPPER PAD OR PLATED HOLES TOUCH BOARD OUTLINE, / FOLLOW GERBER AND ACCEPT COPPER EXPOSED AT BOARD EDGE / / 17. ADD TEARDROPS TO ALL PADS AT TRACE JUNCTIONS | SILKSCREEN TOP / SOLDER MASK TOP / ------------------------- / LAYER 1 - TOP GROUND (1 OZ) / PREPREG: DIELECTRIC (8 MIL) / LAYER 2 - SIGNAL PLANE (1 OZ) / CORE: DIELECTRIC (FILLER) / LAYER 3 - POWER PLANE (1 OZ) / PREPREG: DIELECTRIC (8 MIL) / LAYER 4 - BOTTOM GROUND (1 OZ) / ------------------------- / SOLDER MASK BOTTOM / SILKSCREEN BOTTOM / / / TOTAL BOARD THICKNESS: 62 MIL | FABRICATION